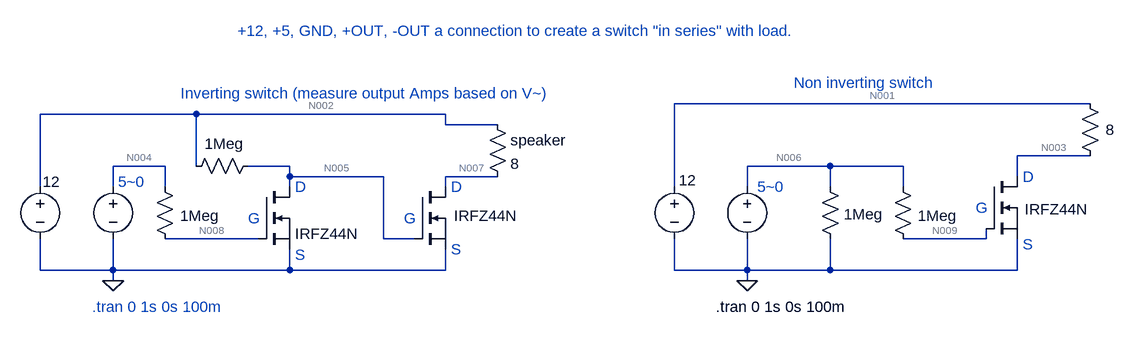
[diagram p0: schematic inverter N-channel.asc]
inverter N-channel.asc, the LTspice schematic file:
Version 4.1
SHEET 1 1248 680
WIRE 912 -208 272 -208
WIRE -464 -192 -704 -192
WIRE -80 -192 -464 -192
WIRE -80 -176 -80 -192
WIRE 0 -176 -80 -176
WIRE 912 -128 800 -128
WIRE -512 -112 -592 -112
WIRE -464 -112 -464 -192
WIRE -320 -112 -384 -112
WIRE 512 -112 384 -112
WIRE 624 -112 512 -112
WIRE -320 -96 -320 -112
WIRE -176 -96 -320 -96
WIRE 0 -96 -80 -96
WIRE 800 -96 800 -128
WIRE -704 -80 -704 -192
WIRE -592 -80 -592 -112
WIRE -512 -80 -512 -112
WIRE -320 -80 -320 -96
WIRE -80 -80 -80 -96
WIRE 272 -80 272 -208
WIRE 384 -80 384 -112
WIRE 512 -80 512 -112
WIRE 624 -80 624 -112
WIRE -368 0 -512 0
WIRE -176 0 -176 -96
WIRE -128 0 -176 0
WIRE 752 0 752 -16
WIRE 752 0 624 0
WIRE -704 48 -704 0
WIRE -592 48 -592 0
WIRE -592 48 -704 48
WIRE -320 48 -320 16
WIRE -320 48 -592 48
WIRE -80 48 -80 16
WIRE -80 48 -320 48
WIRE 272 48 272 0
WIRE 384 48 384 0
WIRE 384 48 272 48
WIRE 512 48 512 0
WIRE 512 48 384 48
WIRE 800 48 800 0
WIRE 800 48 512 48
WIRE -592 64 -592 48
WIRE 384 64 384 48
FLAG 384 64 0
FLAG -592 64 0
SYMBOL res -528 -96 R0
WINDOW 0 36 40 Invisible 2
WINDOW 3 39 60 Left 2
SYMATTR InstName R2
SYMATTR Value 1Meg
SYMBOL res -16 -192 R0
SYMATTR InstName speaker
SYMATTR Value 8
SYMBOL res -480 -96 R270
WINDOW 0 32 56 Invisible 2
WINDOW 3 66 59 VBottom 2
SYMATTR InstName R4
SYMATTR Value 1Meg
SYMBOL nmos -368 -80 R0
WINDOW 0 56 32 Invisible 2
SYMATTR InstName M1
SYMATTR Value IRFZ44N
SYMBOL nmos -128 -80 R0
WINDOW 0 56 32 Invisible 2
WINDOW 3 61 44 Left 2
SYMATTR InstName M2
SYMATTR Value IRFZ44N
SYMBOL res 608 -96 R0
WINDOW 0 36 40 Invisible 2
WINDOW 3 39 60 Left 2
SYMATTR InstName R1
SYMATTR Value 1Meg
SYMBOL res 896 -224 R0
WINDOW 0 36 40 Invisible 2
WINDOW 3 40 56 Left 2
SYMATTR InstName speaker2
SYMATTR Value 8
SYMBOL nmos 752 -96 R0
WINDOW 0 56 32 Invisible 2
WINDOW 3 59 50 Left 2
SYMATTR InstName M4
SYMATTR Value IRFZ44N
SYMBOL voltage -704 -96 R0
WINDOW 123 0 0 Left 0
WINDOW 39 0 0 Left 0
WINDOW 0 24 16 Invisible 2
WINDOW 3 4 8 Left 2
SYMATTR InstName V1
SYMATTR Value 12
SYMBOL voltage -592 -96 R0
WINDOW 123 0 0 Left 0
WINDOW 39 0 0 Left 0
WINDOW 0 24 16 Invisible 2
WINDOW 3 24 96 Invisible 2
SYMATTR InstName V2
SYMATTR Value SINE(2.5 2.5 3 0)
SYMBOL voltage 272 -96 R0
WINDOW 123 0 0 Left 0
WINDOW 39 0 0 Left 0
WINDOW 0 24 16 Invisible 2
WINDOW 3 7 6 Left 2
SYMATTR InstName V3
SYMATTR Value 12
SYMBOL voltage 384 -96 R0
WINDOW 123 0 0 Left 0
WINDOW 39 0 0 Left 0
WINDOW 0 24 16 Invisible 2
WINDOW 3 24 96 Invisible 2
SYMATTR InstName V4
SYMATTR Value SINE(2.5 2.5 3 0)
SYMBOL res 496 -96 R0
WINDOW 0 36 40 Invisible 2
WINDOW 3 37 58 Left 2
SYMATTR InstName R3
SYMATTR Value 1Meg
TEXT -624 104 Left 2 ;.tran 0 1s 0s 100m
TEXT 336 104 Left 2 !.tran 0 1s 0s 100m
TEXT -400 -320 Left 2 ;+12, +5, GND, +OUT, -OUT a connection to create a switch "in series" with load.
TEXT 456 -240 Left 2 ;Non inverting switch
TEXT -488 -224 Left 2 ;Inverting switch (measure output Amps based on V~)
TEXT -312 -80 Left 2 ;D
TEXT 808 -96 Left 2 ;D
TEXT -72 -80 Left 2 ;D
TEXT -312 24 Left 2 ;S
TEXT -72 16 Left 2 ;S
TEXT 808 8 Left 2 ;S
TEXT -384 -32 Left 2 ;G
TEXT -144 -32 Left 2 ;G
TEXT 736 -48 Left 2 ;G
TEXT 400 -80 Left 2 ;5~0
TEXT -584 -88 Left 2 ;5~0

The netlist it stands for:
* inverter N-channel.asc
R2 N004 N008 1Meg
R§speaker N002 N007 8
R4 N002 N005 1Meg
M1 N005 N008 0 0 IRFZ44N
M2 N007 N005 0 0 IRFZ44N
R1 N006 N009 1Meg
R§speaker2 N001 N003 8
M4 N003 N009 0 0 IRFZ44N
V1 N002 0 12
V2 N004 0 SINE(2.5 2.5 3 0)
V3 N001 0 12
V4 N006 0 SINE(2.5 2.5 3 0)
R3 N006 0 1Meg
.model NMOS NMOS
.model PMOS PMOS
.lib standard.mos
* .tran 0 1s 0s 100m
.tran 0 1s 0s 100m
* +12, +5, GND, +OUT, -OUT a connection to create a switch "in series" with load.
* Non inverting switch
* Inverting switch (measure output Amps based on V~)
* D
* D
* D
* S
* S
* S
* G
* G
* G
* 5~0
* 5~0
.backanno
.end

* Results of the author's LTspice run, read from the files saved beside the schematic
* Operating Point, zero values left out:
*   V(n008) = 2.5 V
*   V(n007) = 17.35 mV
*   V(n005) = 12 V
*   V(n009) = 2.5 V
*   V(n004) = 2.5 V
*   V(n002) = 12 V
*   V(n006) = 2.5 V
*   V(n001) = 12 V
*   V(n003) = 12 V
*   I(R4) = 25.42 pA
*   Id(M4) = 13.59 pA
*   Is(M4) = -13.59 pA
*   I(R3) = 2.5 µA
*   Id(M2) = 1.498 A
*   Is(M2) = -1.498 A
*   I(V3) = -25.38 pA
*   Id(M1) = 13.59 pA
*   Is(M1) = -13.59 pA
*   I(V1) = -1.498 A
*   I(speaker) = 1.498 A
*   I(speaker2) = 25.38 pA
*   I(V4) = -2.5 µA
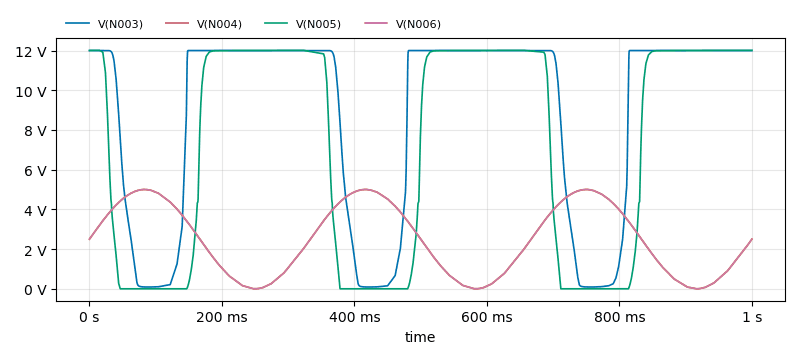
[diagram p1: Transient Analysis of inverter N-channel.asc, plotted from the saved traces]
* Transient Analysis, 1 run:
*   V(N003): min 90.16 mV, max 12 V, average 8.785 V, rms 10.06 V, last 12 V
*   V(N004): min 41.79 µV, max 4.999 V, average 2.506 V, rms 3.07 V, last 2.5 V
*   V(N005): min 0 V, max 12.01 V, average 7.227 V, rms 9.144 V, last 12.01 V
*   V(N006): min 41.79 µV, max 4.999 V, average 2.506 V, rms 3.07 V, last 2.5 V